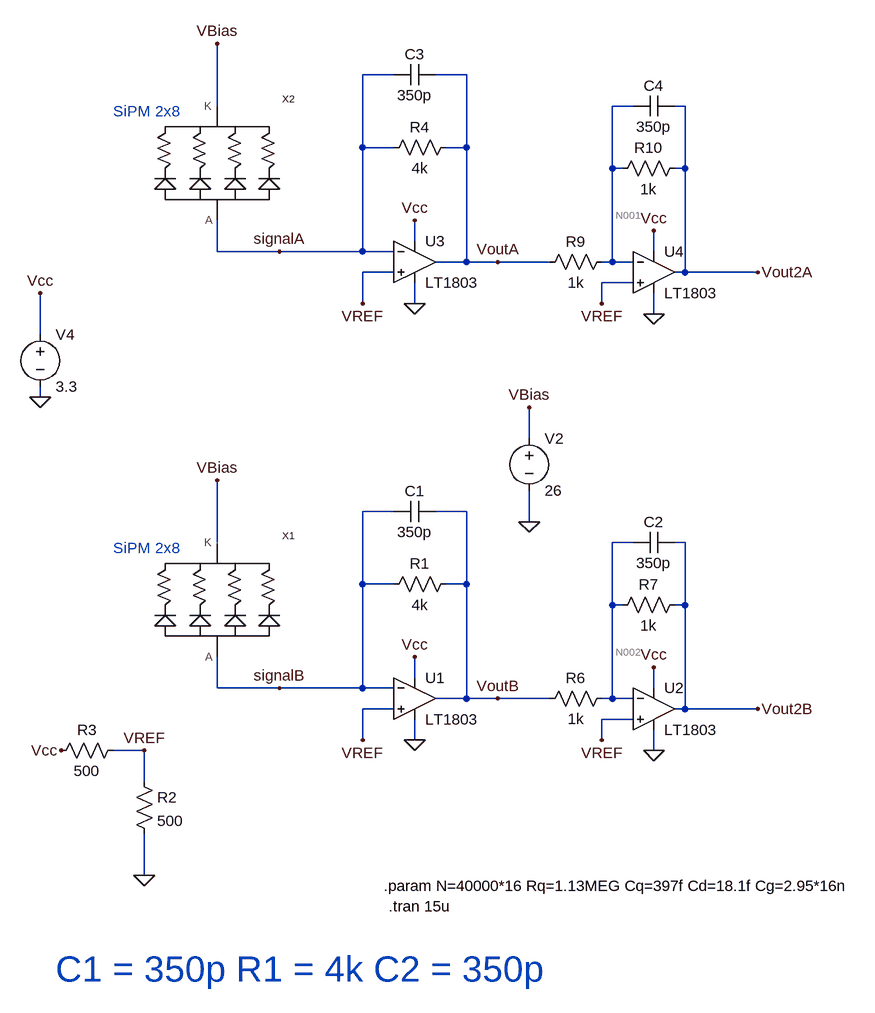
[diagram p0: schematic currentmode_v1.asc]
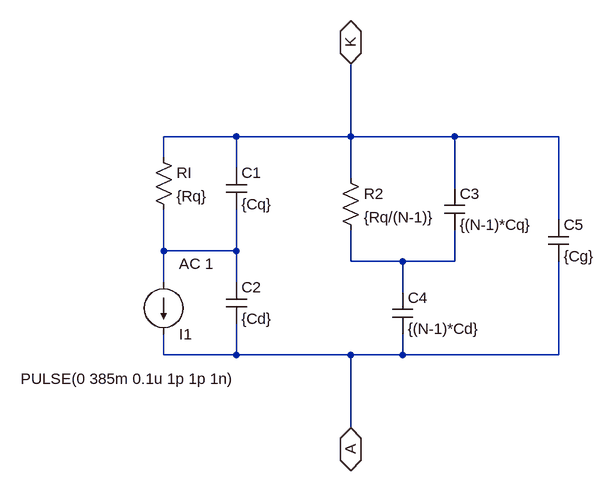
[diagram p1: sub-circuit sipm_equivalente_controllo_tensione_pulse.asc]
* currentmode_v1.asc
X§X1 VBias signalB sipm_equivalente_controllo_tensione_pulse
R1 VoutB signalB 4k
C1 VoutB signalB 350p
* U1: LT1803 (symbol OpAmps\LT1803 not available, pins judged from their places): In+=VREF In-=signalB V+=Vcc V-=0 OUT=VoutB
R2 VREF 0 500
R3 VREF Vcc 500
* U2: LT1803 (symbol OpAmps\LT1803 not available, pins judged from their places): In+=VREF In-=N002 V+=Vcc V-=0 OUT=Vout2B
R6 N002 VoutB 1k
R7 Vout2B N002 1k
C2 Vout2B N002 350p
V4 Vcc 0 3.3
X§X2 VBias signalA sipm_equivalente_controllo_tensione_pulse
R4 VoutA signalA 4k
C3 VoutA signalA 350p
* U3: LT1803 (symbol OpAmps\LT1803 not available, pins judged from their places): In+=VREF In-=signalA V+=Vcc V-=0 OUT=VoutA
* U4: LT1803 (symbol OpAmps\LT1803 not available, pins judged from their places): In+=VREF In-=N001 V+=Vcc V-=0 OUT=Vout2A
R9 N001 VoutA 1k
R10 Vout2A N001 1k
C4 Vout2A N001 350p
V2 VBias 0 26

* block symbol definitions
.subckt sipm_equivalente_controllo_tensione_pulse K A
RI K N001 {Rq}
R2 K N002 {Rq/(N-1)}
C1 K N001 {Cq}
C2 N001 A {Cd}
C3 K N002 {(N-1)*Cq}
C4 N002 A {(N-1)*Cd}
C5 K A {Cg}
I1 N001 A PULSE(0 385m 0.1u 1p 1p 1n) AC 1
.ends sipm_equivalente_controllo_tensione_pulse

.tran 15u
.param N=40000*16 Rq=1.13MEG Cq=397f Cd=18.1f Cg=2.95*16n
* C1 = 350p R1 = 4k C2 = 350p
* SiPM 2x8
* SiPM 2x8
.backanno
.end

* Results of the author's LTspice run, read from the files saved beside the schematic
* Operating Point, zero values left out:
*   V(n001) = 1.649 V
*   V(n002) = 1.649 V
*   V(signala) = 1.649 V
*   V(signalb) = 1.649 V
*   V(vbias) = 26 V
*   V(vcc) = 3.3 V
*   V(vout2a) = 1.642 V
*   V(vout2b) = 1.642 V
*   V(vouta) = 1.658 V
*   V(voutb) = 1.658 V
*   V(vref) = 1.648 V
*   I(R1) = 2.325 µA
*   I(R10) = -6.976 µA
*   I(R2) = 3.295 mA
*   I(R3) = -3.305 mA
*   I(R4) = 2.325 µA
*   I(R6) = -9.301 µA
*   I(R7) = -6.976 µA
*   I(R9) = -9.301 µA
*   I(V4) = -14.9 mA
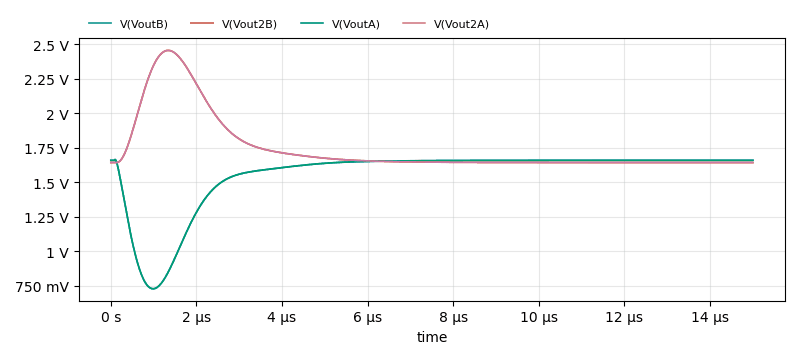
[diagram p2: Transient Analysis of currentmode_v1.asc, plotted from the saved traces]
* Transient Analysis, 1 run:
*   V(VoutB): min 727.4 mV, max 1.664 V, average 1.555 V, rms 1.572 V, last 1.658 V
*   V(Vout2B): min 1.641 V, max 2.454 V, average 1.744 V, rms 1.757 V, last 1.642 V
*   V(VoutA): min 727 mV, max 1.664 V, average 1.555 V, rms 1.572 V, last 1.658 V
*   V(Vout2A): min 1.641 V, max 2.455 V, average 1.744 V, rms 1.757 V, last 1.642 V